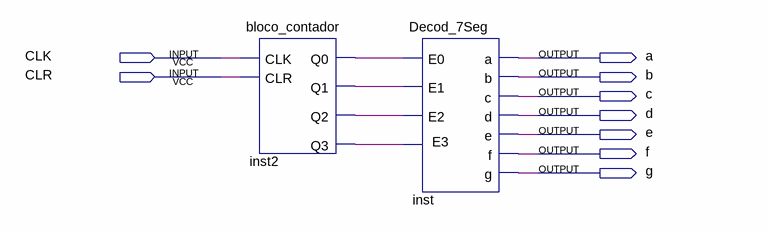
[diagram p0: schematic sheet]
// Quartus schematic contador_blocos.bdf as structural Verilog: 2 symbols, 9 pins
module contador_blocos (
  input  CLK,
  input  CLR,
  output a,
  output b,
  output c,
  output d,
  output e,
  output f,
  output g
);

  wire inst2_q0, inst2_q1, inst2_q2, inst2_q3;

  bloco_contador inst2 (.CLK(CLK), .CLR(CLR), .Q3(inst2_q3), .Q2(inst2_q2), .Q1(inst2_q1), .Q0(inst2_q0));
  Decod_7Seg inst (
    .E3(inst2_q3), .E2(inst2_q2), .E1(inst2_q1), .E0(inst2_q0), .a(a), .b(b), .c(c), .d(d), .e(e), .f(f),
    .g(g));
endmodule
